# EasyEDA Pro project 2025_08_25_usb2spi.epro

# Schematic Schematic1
Board Name: Board1; Create Date: 2025-07-18; Page Name: P1; Project Name: 2025_07_18_ftdi; Schematic Name: Schematic1; Update Date: 2025-07-18; Company: EasyEDA.com; Page Size: A4; Version: V1.0
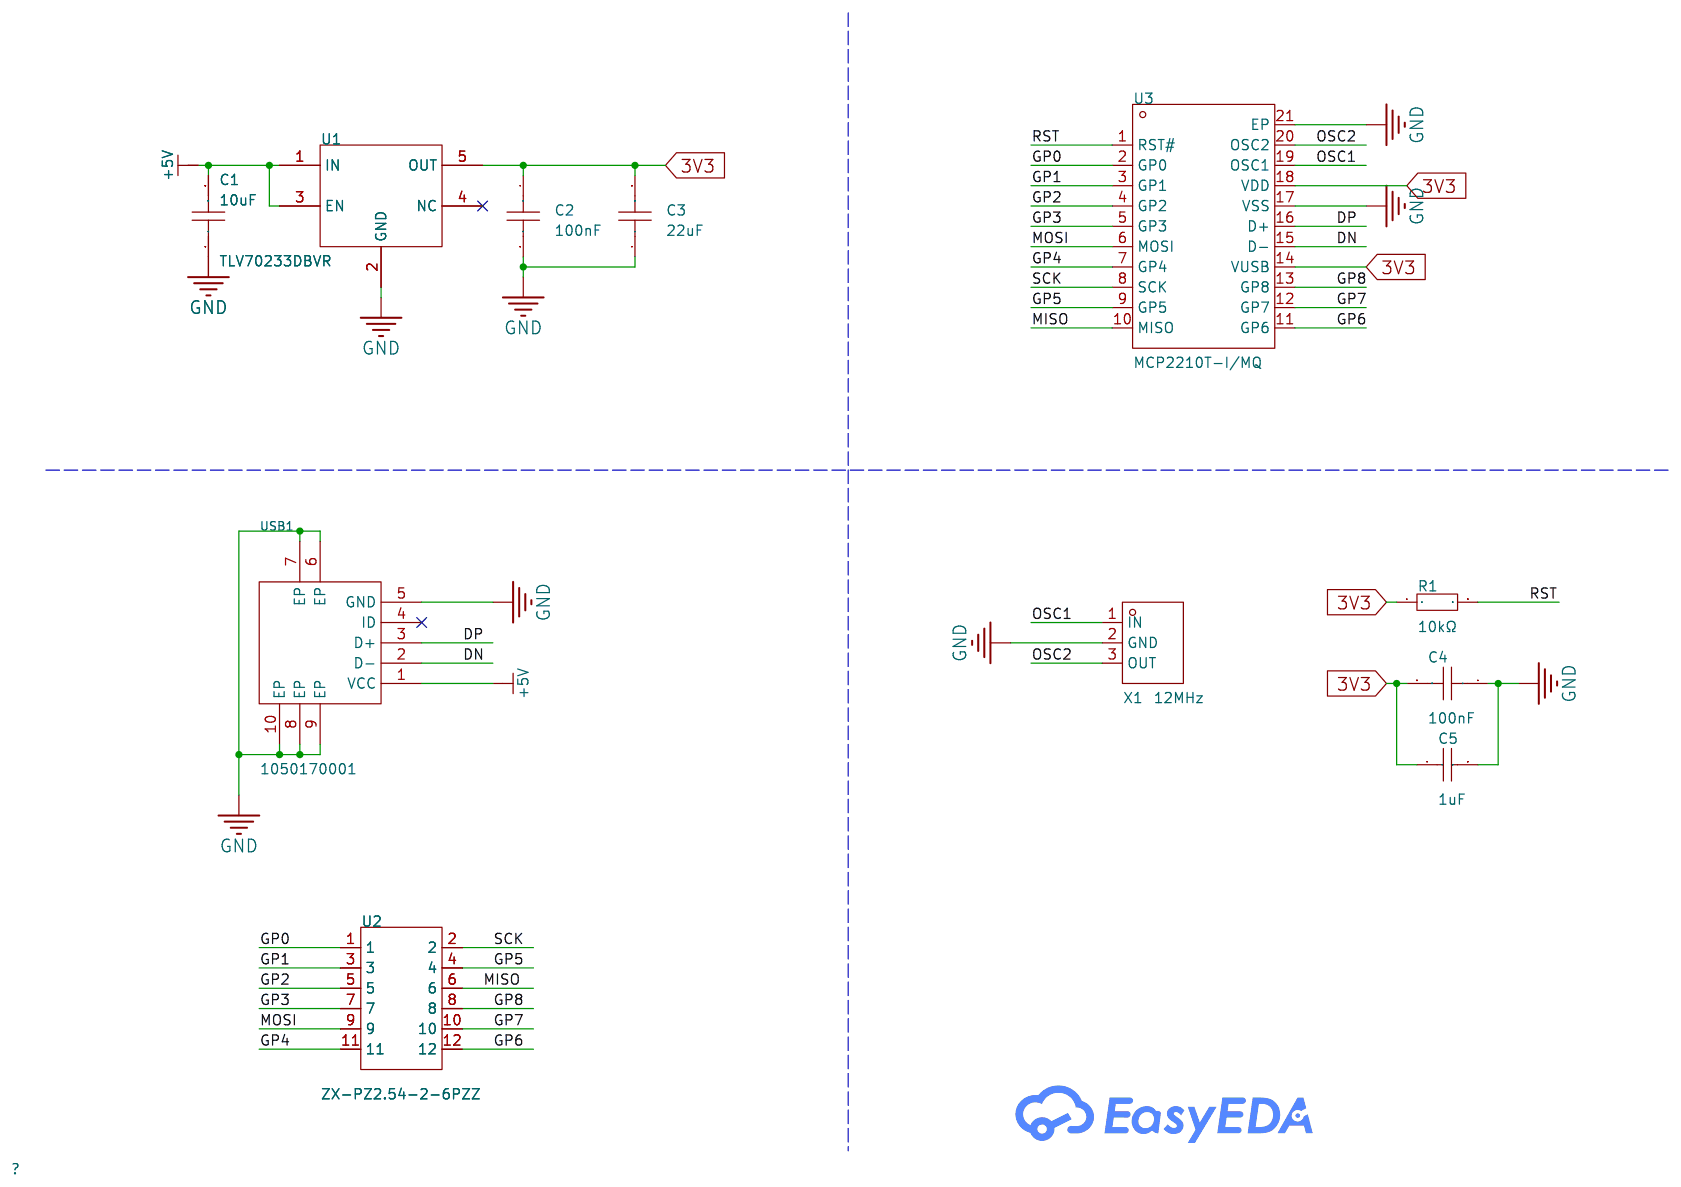
[diagram p0: schematic sheet]

## Parts
C1  10uF  [C0402]
C2  100nF  [C0402]
C3  22uF  [C0402]
C4  100nF  [C0402]
C5  1uF  [C0402]
R1  10kΩ  [R0402]
U1  TLV70233DBVR  [SOT-23-5_L3.0-W1.7-P0.95-LS2.8-BR]
U2  ZX-PZ2.54-2-6PZZ  [HDR-TH_12P-P2.54-V-M-R2-C6-S2.54]
U3  MCP2210T-I/MQ  [QFN-20_L5.0-W5.0-P0.65-BL-EP3.3]
USB1  1050170001  [MICRO-USB-SMD_105017-0001]
X1  12MHz  [CRYSTAL-SMD_3P-L3.2-W1.3-P1.2-BL]

## Library data of the parts
C1 = CL05A106MP5NUNC_C315248: Capacitance: Tolerance:±20% Tolerance:±20% Voltage Rated: Temperature Coefficient:; LCSC Part Name: 10uF ±20% 10V; Supplier Part: C315248; Manufacturer: SAMSUNG(三星); Manufacturer Part: CL05A106MP5NUNC; Supplier Footprint: 0402; JLCPCB Part Class: Extended Part; Datasheet: https://atta.szlcsc.com/upload/public/pdf/source/20231220/1EF805BAE1520675928CC4638D279E74.pdf; Supplier: LCSC; Tolerance: ±20%
C2 C4 = CL05B104KO5NNNC: Capacitance: Tolerance:±10% Tolerance:±10% Voltage Rated: Temperature Coefficient:; LCSC Part Name: 100nF ±10% 16V; Supplier Part: C1525; Manufacturer: SAMSUNG(三星); Supplier Footprint: 0402; JLCPCB Part Class: Basic Part; Datasheet: https://atta.szlcsc.com/upload/public/pdf/source/20160218/1457707763339.pdf; Supplier: LCSC; Tolerance: ±10%
C3 = GRM155R60J226ME11D: Capacitance:22uF Tolerance:±20% Tolerance:±20% Voltage Rating:6.3V Temperature Coefficient:X5R; LCSC Part Name: 22uF ±20% 6.3V; Supplier Part: C415703; Manufacturer: muRata(村田); Supplier Footprint: 0402; JLCPCB Part Class: Extended Part; Datasheet: https://atta.szlcsc.com/upload/public/pdf/source/20200305/C490387_23319AE8C154DEB24C505E6C82A8106A.pdf; Supplier: LCSC; Tolerance: ±20%; Voltage Rating: 6.3V; Temperature Coefficient: X5R
C5 = CL05A105KP5NNNC: Capacitance:1uF Tolerance:±10% Tolerance:±10% Voltage Rating:10V Temperature Coefficient:X5R; LCSC Part Name: 1uF ±10% 10V; Supplier Part: C14445; Manufacturer: SAMSUNG(三星); Supplier Footprint: 0402; JLCPCB Part Class: Extended Part; Datasheet: https://item.szlcsc.com/datasheet/CL05A105KP5NNNC/15107.html; Supplier: LCSC; Tolerance: ±10%; Voltage Rating: 10V; Temperature Coefficient: X5R
R1 = RC0402FR-0710KL: Type:Thick Film Resistor Resistance:10kΩ Tolerance:±1% Tolerance:±1% Power(Watts):62.5mW Voltage-Supply(Max):50V Temperature Coefficient:±100ppm/℃ Temperature Coefficient:±100ppm/℃ Operating Temperature:-55℃~+155℃ Operating Temperature:-55℃~+155℃; LCSC Part Name: 厚膜电阻 10kΩ ±1% 62.5mW; Supplier Part: C60490; Manufacturer: YAGEO(国巨); Supplier Footprint: 0402; JLCPCB Part Class: Extended Part; Datasheet: https://item.szlcsc.com/datasheet/RC0402FR-0710KL/61542.html; Supplier: LCSC; Type: Thick Film Resistor; Tolerance: ±1%; Power(Watts): 62.5mW; Voltage-Supply(Max): 50V; Temperature Coefficient: ±100ppm/℃; Operating Temperature: -55℃~+155℃
U1 = TLV70233DBVR: Output Type:Fixed Maximum Input Voltage:5.5V Output Voltage:3.3V Output Voltage:3.3V Output Current:300mA Power Supply Rejection Ratio (PSRR):68dB@(1kHz) Dropout Voltage:375mV@(300mA) standby current:55uA Feature:ESD Protection；Low ESR；Thermal Protection(; LCSC Part Name: 具有使能功能的 300mA、高 PSRR、低 IQ、低压降稳压器; Supplier Part: C26833; Manufacturer: TI(德州仪器); Supplier Footprint: SOT-23-5; JLCPCB Part Class: Extended Part; Datasheet: https://www.ti.com/cn/lit/gpn/tlv702; Supplier: LCSC; Output Type: Fixed; Maximum Input Voltage: 5.5V; Output Voltage: 3.3V; Output Current: 300mA; Power Supply Rejection Ratio (PSRR): 68dB@(1kHz); Dropout Voltage: 375mV@(300mA); standby current: 55uA; Feature: ESD Protection；Low ESR；Thermal Protection(TSD)；Under-voltage Lockout；Overcurrent Protection(OCP)；With ability; Operating Temperature: -40℃~+125℃@(Tj); Output Polarity: Positive electrode; Number of Outputs: 1
U2 = ZX-PZ2.54-2-6PZZ: Pin Structure:2x6P Pitch:2.54mm Row Spacing:2.54mm Circluar Pins/Square Pins:Pin Header Mounting Type:Through Hole Number of Rows:2 Number of Pins:12P Current Rating:3A Voltage Rating (Max):1kV Length of Mating Pin:6mm Insulation Height:2.5mm Length of En; LCSC Part Name: 2x6P 间距:2.54mm 方针 直插; Supplier Part: C7501277; Manufacturer: Megastar(兆星); Supplier Footprint: 插件,P=2.54mm; Datasheet: https://item.szlcsc.com/datasheet/ZX-PZ2.54-2-6PZZ/8582490.html; Supplier: LCSC; Pin Structure: 2x6P; Pitch: 2.54mm; Row Spacing: 2.54mm; Circluar Pins/Square Pins: Pin Header; Mounting Type: Through Hole; Number of Rows: 2; Number of Pins: 12P; Current Rating: 3A; Voltage Rating (Max): 1kV; Length of Mating Pin: 6mm; Insulation Height: 2.5mm; Length of End Connection Pin: 3mm; Contact Material: Brass; Contact Plating: Gold; Operating Temperature: -40℃~+105℃; Color: Black
U3 = MCP2210T-I/MQ: Applications Function:USB to SPI Protocol: Number of Channels:8 Supply Voltage:3.3V；5.5V Supply Voltage:3.3V；5.5V Data Rate:12Mbps Operating Temperature:-40℃~+85℃ Operating Temperature:-40℃~+85℃; LCSC Part Name: USB转SPI协议转换器带GPIO (主机模式); Supplier Part: C623180; Manufacturer: MICROCHIP(美国微芯); Supplier Footprint: QFN-20-EP(5x5); JLCPCB Part Class: Extended Part; Datasheet: https://atta.szlcsc.com/upload/public/pdf/source/20221017/CAD9BCC67D07360384CF79DCF0152CC4.pdf; Supplier: LCSC; Applications Function: USB to SPI; Number of Channels: 8; Supply Voltage: 3.3V；5.5V; Data Rate: 12Mbps; Operating Temperature: -40℃~+85℃
USB1 = 1050170001: Connector Type:Micro-B Standard:USB 2.0 Gender:Female Number of Ports:1 Number of Contacts:5P Mounting Style:卧贴 Current Rating - Power (Max):- Operating Temperature Range:-30℃~+85℃ Operating Temperature Range:-30℃~+85℃; LCSC Part Name: Micro-B 母 卧贴; Supplier Part: C136000; Manufacturer: MOLEX; Supplier Footprint: SMD; JLCPCB Part Class: Extended Part; Datasheet: https://atta.szlcsc.com/upload/public/pdf/source/20171113/C136000_15105610884381115465.pdf; Supplier: LCSC; Connector Type: Micro-B; Standard: USB 2.0; Gender: Female; Number of Ports: 1; Number of Contacts: 5P; Mounting Style: 卧贴; Operating Temperature Range: -30℃~+85℃
X1 = CSTNE12M0G55A000R0: Frequency: Built-in Load Capacitance: Resonant Impedance: Operating Temperature:-40℃~+125℃ Operating Temperature:-40℃~+125℃; LCSC Part Name: 12MHz ±0.5% 内置负载电容:33pF; Supplier Part: C907940; Manufacturer: muRata(村田); Supplier Footprint: SMD3213-3P; JLCPCB Part Class: Extended Part; Datasheet: https://atta.szlcsc.com/upload/public/pdf/source/20201022/C907940_4E575DE2FEFEA5C8097153557E269E2E.pdf; Supplier: LCSC; Operating Temperature: -40℃~+125℃

## Nets
3V3: C2.1 C3.2 C4.2 C5.1 R1.1 U1.5(OUT) U3.14(VUSB) U3.18(VDD)
+5V: C1.2 U1.1(IN) U1.3(EN) USB1.1(VCC)
GND: C1.1 C2.2 C3.1 C4.1 C5.2 U1.2(GND) U3.17(VSS) U3.21(EP) USB1.5(GND) USB1.6(EP) USB1.7(EP) USB1.8(EP) USB1.9(EP) USB1.10(EP) X1.2(GND)
DN: U3.15(D-) USB1.2(D-)
DP: U3.16(D+) USB1.3(D+)
GP0: U2.1 U3.2(GP0)
GP1: U2.3 U3.3(GP1)
GP2: U2.5 U3.4(GP2)
GP3: U2.7 U3.5(GP3)
GP4: U2.11 U3.7(GP4)
GP5: U2.4 U3.9(GP5)
GP6: U2.12 U3.11(GP6)
GP7: U2.10 U3.12(GP7)
GP8: U2.8 U3.13(GP8)
MISO: U2.6 U3.10(MISO)
MOSI: U2.9 U3.6(MOSI)
OSC1: U3.19(OSC1) X1.1(IN)
OSC2: U3.20(OSC2) X1.3(OUT)
RST: R1.2 U3.1(RST#)
SCK: U2.2 U3.8(SCK)

Not connected (* = marked no-connect by the designer): U1 4(NC)*; USB1 4(ID)*

# Board PCB1
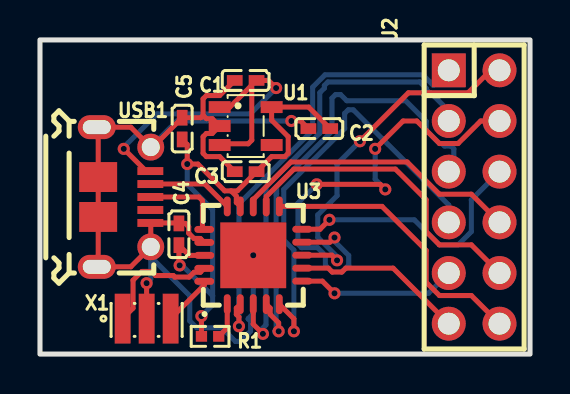
[diagram p1: board, top side]
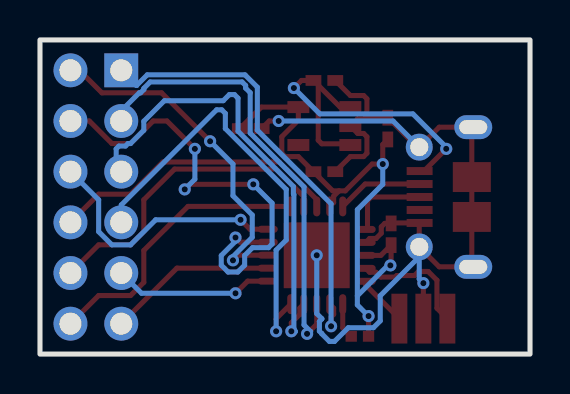
[diagram p2: board, bottom side, seen from below]

Outline 24.51 x 15.75 mm; copper layers: Top Layer, Bottom Layer. Coordinates in mm from the lower left corner of the outline.
Outline path: rectangle 0,15.75 24.51,0
Stack: Top Layer 0.035mm / Dielectric1 1.51mm FR4 er 4.5 / Bottom Layer 0.035mm

## Design rules (mm)
template: JLCPCB Capability(Two Layers Board)
spacing copperThickness1oz (default): track to track 0.102, other pairs 0.152 to 0.3
spacing copperThickness2oz: track to track 0.203, other pairs 0.152 to 0.3
track width copperThickness1oz (default): min 0.127, default 0.254, max 2.54
track width copperThickness2oz: min 0.203, default 0.254, max 2.54
differential pair differentialPair (default): width min 0.127, default 0.254, max 2.54; gap min 0.152, default 0.152
via viaSize (default): diameter min 0.5, default 0.61, max 10; hole min 0.3, default 0.305, max 6.3

## Placement (name value [footprint] x y rotation side)
C1  10uF  [C0402]  10.29 13.72 0 top
C2  100nF  [C0402]  13.97 11.3 180 top
C3  22uF  [C0402]  10.29 9.14 0 top
C4  100nF  [C0402]  6.95 6.01 270 top
C5  1uF  [C0402]  7.11 11.3 90 top
R1  10kΩ  [R0402]  8.51 0.89 0 top
U1  TLV70233DBVR  [SOT-23-5_L3.0-W1.7-P0.95-LS2.8-BR]  10.29 11.43 180 top
U2  ZX-PZ2.54-2-6PZZ  [HDR-TH_12P-P2.54-V-M-R2-C6-S2.54]  21.72 7.87 270 top
U3  MCP2210T-I/MQ  [QFN-20_L5.0-W5.0-P0.65-BL-EP3.3]  10.67 4.95 0 top
USB1  1050170001  [MICRO-USB-SMD_105017-0001]  4.19 7.87 270 top
X1  12MHz  [CRYSTAL-SMD_3P-L3.2-W1.3-P1.2-BL]  5.33 1.78 0 top

## Footprints (pads in the part's own frame, mm; a bottom-side part is the same pattern mirrored in y, then rotated)
C0402
  rect 0.79x0.54 smd: 1(-0.545,0) 2(0.545,0)
CRYSTAL-SMD_3P-L3.2-W1.3-P1.2-BL
  rect 0.8x2.5 smd: 1(-1.2,0) 2(0,0) 3(1.2,0)
HDR-TH_12P-P2.54-V-M-R2-C6-S2.54
  rect 1.7x1.7 hole 1.1: 1(-6.35,-1.27)
  round 1.7 hole 1.1: 2(-6.35,1.27) 3(-3.81,-1.27) 4(-3.81,1.27) 5(-1.27,-1.27) 6(-1.27,1.27) 7(1.27,-1.27) 8(1.27,1.27) 9(3.81,-1.27) 10(3.81,1.27) 11(6.35,-1.27) 12(6.35,1.27)
MICRO-USB-SMD_105017-0001
  rect 0.4x1.3 smd: 1(-1.3,1.33) 2(-0.65,1.33) 3(0,1.33) 4(0.65,1.33) 5(1.3,1.33)
  round 1.35 hole 0.9: 6(-2.5,1.35) 7(2.5,1.35)
  oval 1.2x1.9 hole 0.7x1.4: 8(3.5,-1.35) 9(-3.5,-1.35)
  rect 1.5x1.9 smd: 10(-1,-1.28) 10(1,-1.28)
QFN-20_L5.0-W5.0-P0.65-BL-EP3.3
  oval 0.35x1 smd: 1(-1.3,-2.45) 2(-0.65,-2.45) 3(0,-2.45) 4(0.65,-2.45) 5(1.3,-2.45) 11(1.3,2.45) 12(0.65,2.45) 13(0,2.45) 14(-0.65,2.45) 15(-1.3,2.45)
  oval 1x0.35 smd: 6(2.45,-1.296) 7(2.45,-0.645) 8(2.45,0.005) 9(2.45,0.655) 10(2.45,1.306) 16(-2.45,1.296) 17(-2.45,0.645) 18(-2.45,-0.005) 19(-2.45,-0.655) 20(-2.45,-1.306)
  rect 3.3x3.3 smd: 21(0,0)
R0402
  rect 0.566x0.54 smd: 1(-0.433,0) 2(0.433,0)
SOT-23-5_L3.0-W1.7-P0.95-LS2.8-BR
  rect 1.1x0.6 smd: 1(1.3,-0.95) 2(1.3,0) 3(1.3,0.95) 4(-1.3,0.95) 5(-1.3,-0.95)

## Nets
As in the schematic.

Pads without a net: U1 4; USB1 4

## Via types
v1: diameter 0.61, hole 0.305, Top Layer to Bottom Layer, 20 vias

## Routing (per net, layer and track width the routed paths; a pad name or vN(x,y) marks a point on that pad's centre or on a via; arc(x,y) is an arc through that point)
3V3: length 29
  Top Layer w0.254: v1(6.99,4.45) 6.95,4.48 C4.2 7.46,4.95 U3.18 ; 9.56,8.18 9.24,8.18 7.9,9.53 v1(7.37,9.53) 7.37,10.5 C5.1 ; 9.56,8.18 9.87,8.18 C3.2 11.59,9.9 12.25,9.9 12.42,10.06 12.42,10.9 11.59,11.72 U1.5 13.44,12.38 C2.1 14.48,11.27 ; 9.56,8.18 9.82,7.92 9.82,7.6 U3.14 ; R1.1 v1(8.08,1.91)
  Bottom Layer w0.254: 8.64,2.92 7.11,4.45 v1(6.99,4.45) ; 8.64,2.92 8.64,2.47 v1(8.08,1.91) ; 8.64,2.92 8.64,7.24 7.37,8.51 v1(7.37,9.53)
+5V: length 18.4
  Top Layer w0.254: U1.1 9.5,12.38 10.59,13.48 10.59,10.72 10.41,10.54 9.05,10.54 U1.3 ; 5.52,9.17 5.3,9.17 v1(4.19,10.29) ; v1(11.81,13.34) 11.43,13.72 C1.2
  Bottom Layer w0.254: v1(11.81,13.34) 10.52,12.04 5.86,12.04 4.19,10.37 v1(4.19,10.29)
GND: length 52.7
  Top Layer w0.254: C2.2 13.04,11.68 v1(12.57,11.68) ; U3.17 8.02,5.79 7.71,5.79 7.44,6.06 7.44,6.38 7.26,6.55 C4.1 6.93,6.57 5.52,6.57 5.54,6.55 USB1.7 4.54,4.37 USB1.8 2.91,4.44 USB1.10 USB1.10 2.91,11.3 USB1.9 4.54,11.37 USB1.6 5.64,10.37 C5.2 8.04,11.85 8.16,11.96 ; 8.16,11.96 8.16,12.8 8.32,12.96 8.99,12.96 C1.1 ; 8.16,11.96 8.32,11.8 8.62,11.8 U1.2 8.62,11.06 8.32,11.06 8.16,10.9 8.16,10.06 8.32,9.9 8.99,9.9 C3.1 ; X1.2 v1(5.33,3.56)
  Bottom Layer w0.254: 5.54,4.87 7.49,2.92 7.49,1.66 7.83,1.32 9.09,1.32 9.78,0.64 10.03,0.64 10.41,1.02 10.41,1.03 10.54,1.15 10.54,1.64 10.41,1.76 10.41,1.78 10.67,2.03 v1(10.67,4.95) ; 5.54,4.87 5.54,3.76 v1(5.33,3.56) ; 5.54,4.87 USB1.7 ; USB1.6 6.85,11.68 v1(12.57,11.68)
DN: length 4.3
  Top Layer w0.254: 5.52,8.52 8.25,8.52 U3.15
DP: length 4.2
  Top Layer w0.254: U3.16 8.13,6.34 8.13,7.69 7.95,7.87 5.52,7.87
GP0: length 22.4
  Top Layer w0.254: U3.2 9.82,2.31 9.82,1.99 9.95,1.86 v1(9.95,1.4)
  Bottom Layer w0.254: U2.1 19.69,13.47 19.67,13.47 19.15,14 14.26,14 13.64,13.38 13.64,11.22 9.95,7.53 v1(9.95,1.4)
GP1: length 23
  Top Layer w0.254: v1(11.15,1.02) 10.67,1.5 U3.3
  Bottom Layer w0.254: U2.3 20.45,12.19 19.54,13.09 19.48,13.09 19.32,13.26 19.32,13.32 19,13.64 14.4,13.64 14.22,13.46 14.22,13.33 14,13.1 14,11.07 11.3,8.38 11.3,1.46 10.97,1.13 11.04,1.13 v1(11.15,1.02)
GP2: length 23.5
  Top Layer w0.254: U3.4 11.51,2.31 11.51,1.99 11.94,1.57 v1(11.94,1.14)
  Bottom Layer w0.254: v1(11.94,1.14) 11.93,1.13 11.74,1.13 11.81,1.21 11.81,8 11.84,8.03 11.84,8.4 14.6,11.17 14.6,12.83 14.78,13.01 15.04,13.01 15.34,12.7 18.29,12.7 19.32,11.67 19.32,11.22 19.98,10.56 20.11,10.56 20.23,10.43 20.56,10.43 20.7,10.29 20.7,9.4 U2.5
GP3: length 22.2
  Top Layer w0.254: U3.5 12.7,1.77 v1(12.7,1.14)
  Bottom Layer w0.254: U2.7 20.45,7.47 15.67,12.24 15.42,12.24 15.24,12.06 15.24,11.3 12.19,8.26 12.19,5.72 12.7,5.21 v1(12.7,1.14)
GP4: length 8.6
  Top Layer w0.254: U2.11 17.66,4.31 15.29,4.31 15.1,4.12 14.62,4.12 14.42,4.31 U3.7
GP5: length 23.8
  Top Layer w0.254: v1(16.76,10.29) 18.16,11.68 18.85,11.68 19.98,10.56 20.91,10.56 22.04,11.68 U2.4 ; U3.9 14.5,5.61 v1(14.73,5.84) ; v1(13.84,8.51) 17.02,8.51 v1(17.27,8.26)
  Bottom Layer w0.254: v1(17.27,8.26) 16.76,8.76 v1(16.76,10.29) ; v1(14.73,5.84) 14.73,5.65 15.44,4.94 15.44,4.46 15.1,4.12 14.62,4.12 14.28,4.46 14.28,4.94 13.88,5.33 13.08,5.33 12.9,5.51 12.9,7.57 v1(13.84,8.51)
GP6: length 14.4
  Top Layer w0.254: U3.11 17.11,7.4 19.32,5.19 19.32,3.6 19.98,2.94 21.58,2.94 U2.12
GP7: length 15.8
  Top Layer w0.254: U3.12 11.32,7.89 12.7,9.27 17.78,9.27 19.32,7.73 19.32,6.14 19.98,5.48 21.58,5.48 U2.10
GP8: length 14.7
  Top Layer w0.254: U3.13 10.67,7.75 12.55,9.63 18.37,9.63 19.98,8.02 21.58,8.02 U2.8
MISO: length 13
  Top Layer w0.254: v1(14.48,6.73) 14.01,6.26 U3.10
  Bottom Layer w0.254: U2.6 21.58,7.73 21.58,6.14 20.91,5.48 19.98,5.48 18.72,6.73 v1(14.48,6.73)
MOSI: length 8
  Top Layer w0.254: U3.6 14.12,3.66 v1(14.73,3.05)
  Bottom Layer w0.254: v1(14.73,3.05) 19.43,3.05 U2.9
OSC1: length 6.2
  Top Layer w0.254: X1.1 4.66,2.3 4.66,3.7 5.09,4.14 5.58,4.14 5.78,3.94 6.67,3.94 6.74,3.86 7.46,3.86 7.71,4.1 8.02,4.1 U3.19
OSC2: length 2.6
  Top Layer w0.254: U3.20 8.22,3.46 X1.3
RST: length 1.8
  Top Layer w0.254: R1.2 9.37,1.31 U3.1
SCK: length 17.5
  Top Layer w0.254: U2.2 22.54,14.22 21.41,13.09 18.43,13.09 v1(16,10.67) ; v1(14.86,4.7) 14.6,4.96 U3.8
  Bottom Layer w0.254: v1(14.86,4.7) 14.86,4.89 13.89,5.85 13.89,6.97 14.86,7.94 14.86,9.53 v1(16,10.67)
